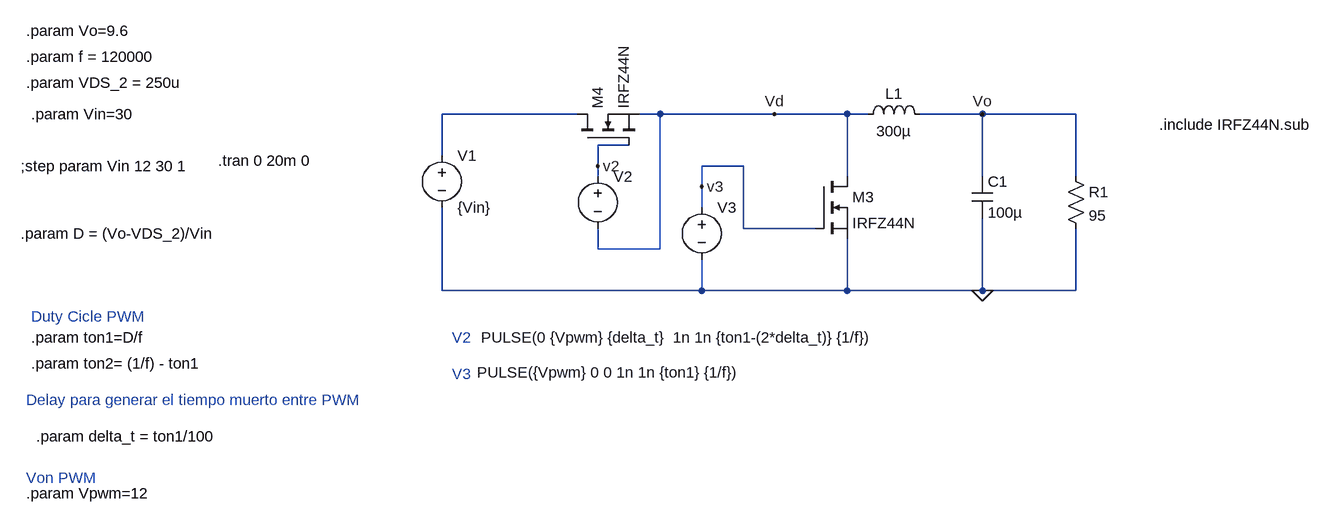
[diagram p0: schematic modddd.asc]
modddd.asc, the LTspice schematic file:
Version 4.1
SHEET 1 1364 732
WIRE 240 48 32 48
WIRE 368 48 336 48
WIRE 544 48 368 48
WIRE 656 48 544 48
WIRE 688 48 656 48
WIRE 864 48 768 48
WIRE 1008 48 864 48
WIRE 320 96 272 96
WIRE 32 112 32 48
WIRE 272 128 272 96
WIRE 496 128 432 128
WIRE 272 144 272 128
WIRE 656 144 656 48
WIRE 864 144 864 48
WIRE 1008 144 1008 48
WIRE 432 160 432 128
WIRE 432 192 432 160
WIRE 496 224 496 128
WIRE 608 224 496 224
WIRE 272 256 272 224
WIRE 368 256 368 48
WIRE 368 256 272 256
WIRE 32 320 32 192
WIRE 432 320 432 272
WIRE 432 320 32 320
WIRE 656 320 656 240
WIRE 656 320 432 320
WIRE 864 320 864 208
WIRE 864 320 656 320
WIRE 1008 320 1008 224
WIRE 1008 320 864 320
FLAG 864 320 0
FLAG 864 48 Vo
FLAG 544 48 Vd
FLAG 272 128 v2
FLAG 432 160 v3
SYMBOL voltage 32 96 R0
WINDOW 123 0 0 Left 0
WINDOW 39 0 0 Left 0
SYMATTR InstName V1
SYMATTR Value {Vin}
SYMBOL voltage 272 128 R0
WINDOW 3 -180 264 Left 2
WINDOW 123 0 0 Left 0
WINDOW 39 0 0 Left 0
SYMATTR Value PULSE(0 {Vpwm} {delta_t}  1n 1n {ton1-(2*delta_t)} {1/f})
SYMATTR InstName V2
SYMBOL ind 672 64 R270
WINDOW 0 32 56 VTop 2
WINDOW 3 5 56 VBottom 2
SYMATTR InstName L1
SYMATTR Value 300µ
SYMBOL cap 848 144 R0
SYMATTR InstName C1
SYMATTR Value 100µ
SYMBOL res 992 128 R0
SYMATTR InstName R1
SYMATTR Value 95
SYMBOL voltage 432 176 R0
WINDOW 123 0 0 Left 0
WINDOW 39 0 0 Left 0
WINDOW 3 -346 270 Left 2
SYMATTR Value PULSE({Vpwm} 0 0 1n 1n {ton1} {1/f})
SYMATTR InstName V3
SYMBOL nmos 608 144 R0
SYMATTR InstName M3
SYMATTR Value IRFZ44N
SYMBOL nmos 240 96 R270
SYMATTR InstName M4
SYMATTR Value IRFZ44N
TEXT -312 120 Left 2 !.tran 0 20m 0
TEXT -616 128 Left 2 !;step param Vin 12 30 1
TEXT -600 392 Left 2 !.param ton1=D/f
TEXT -600 48 Left 2 !.param Vin=30
TEXT -608 632 Left 2 !.param Vpwm=12
TEXT 1136 64 Left 2 !.include IRFZ44N.sub
TEXT -600 432 Left 2 !.param ton2= (1/f) - ton1
TEXT -608 488 Left 2 ;Delay para generar el tiempo muerto entre PWM
TEXT -600 360 Left 2 ;Duty Cicle PWM
TEXT -608 608 Left 2 ;Von PWM
TEXT 48 392 Left 2 ;V2
TEXT 48 448 Left 2 ;V3
TEXT -616 232 Left 2 !.param D = (Vo-VDS_2)/Vin
TEXT -608 0 Left 2 !.param VDS_2 = 250u
TEXT -608 -40 Left 2 !.param f = 120000
TEXT -608 -80 Left 2 !.param Vo=9.6
TEXT -592 544 Left 2 !.param delta_t = ton1/100

The netlist it stands for:
* modddd.asc
V1 N001 0 {Vin}
V2 v2 Vd PULSE(0 {Vpwm} {delta_t}  1n 1n {ton1-(2*delta_t)} {1/f})
L1 Vd Vo 300µ
C1 Vo 0 100µ
R1 Vo 0 95
V3 v3 0 PULSE({Vpwm} 0 0 1n 1n {ton1} {1/f})
M3 Vd v3 0 0 IRFZ44N
M4 N001 v2 Vd Vd IRFZ44N
.model NMOS NMOS
.model PMOS PMOS
.lib standard.mos
.tran 0 20m 0
;step param Vin 12 30 1
.param ton1=D/f
.param Vin=30
.param Vpwm=12
.include IRFZ44N.sub
.param ton2= (1/f) - ton1
* Delay para generar el tiempo muerto entre PWM
* Duty Cicle PWM
* Von PWM
* V2
* V3
.param D = (Vo-VDS_2)/Vin
.param VDS_2 = 250u
.param f = 120000
.param Vo=9.6
.param delta_t = ton1/100
.backanno
.end